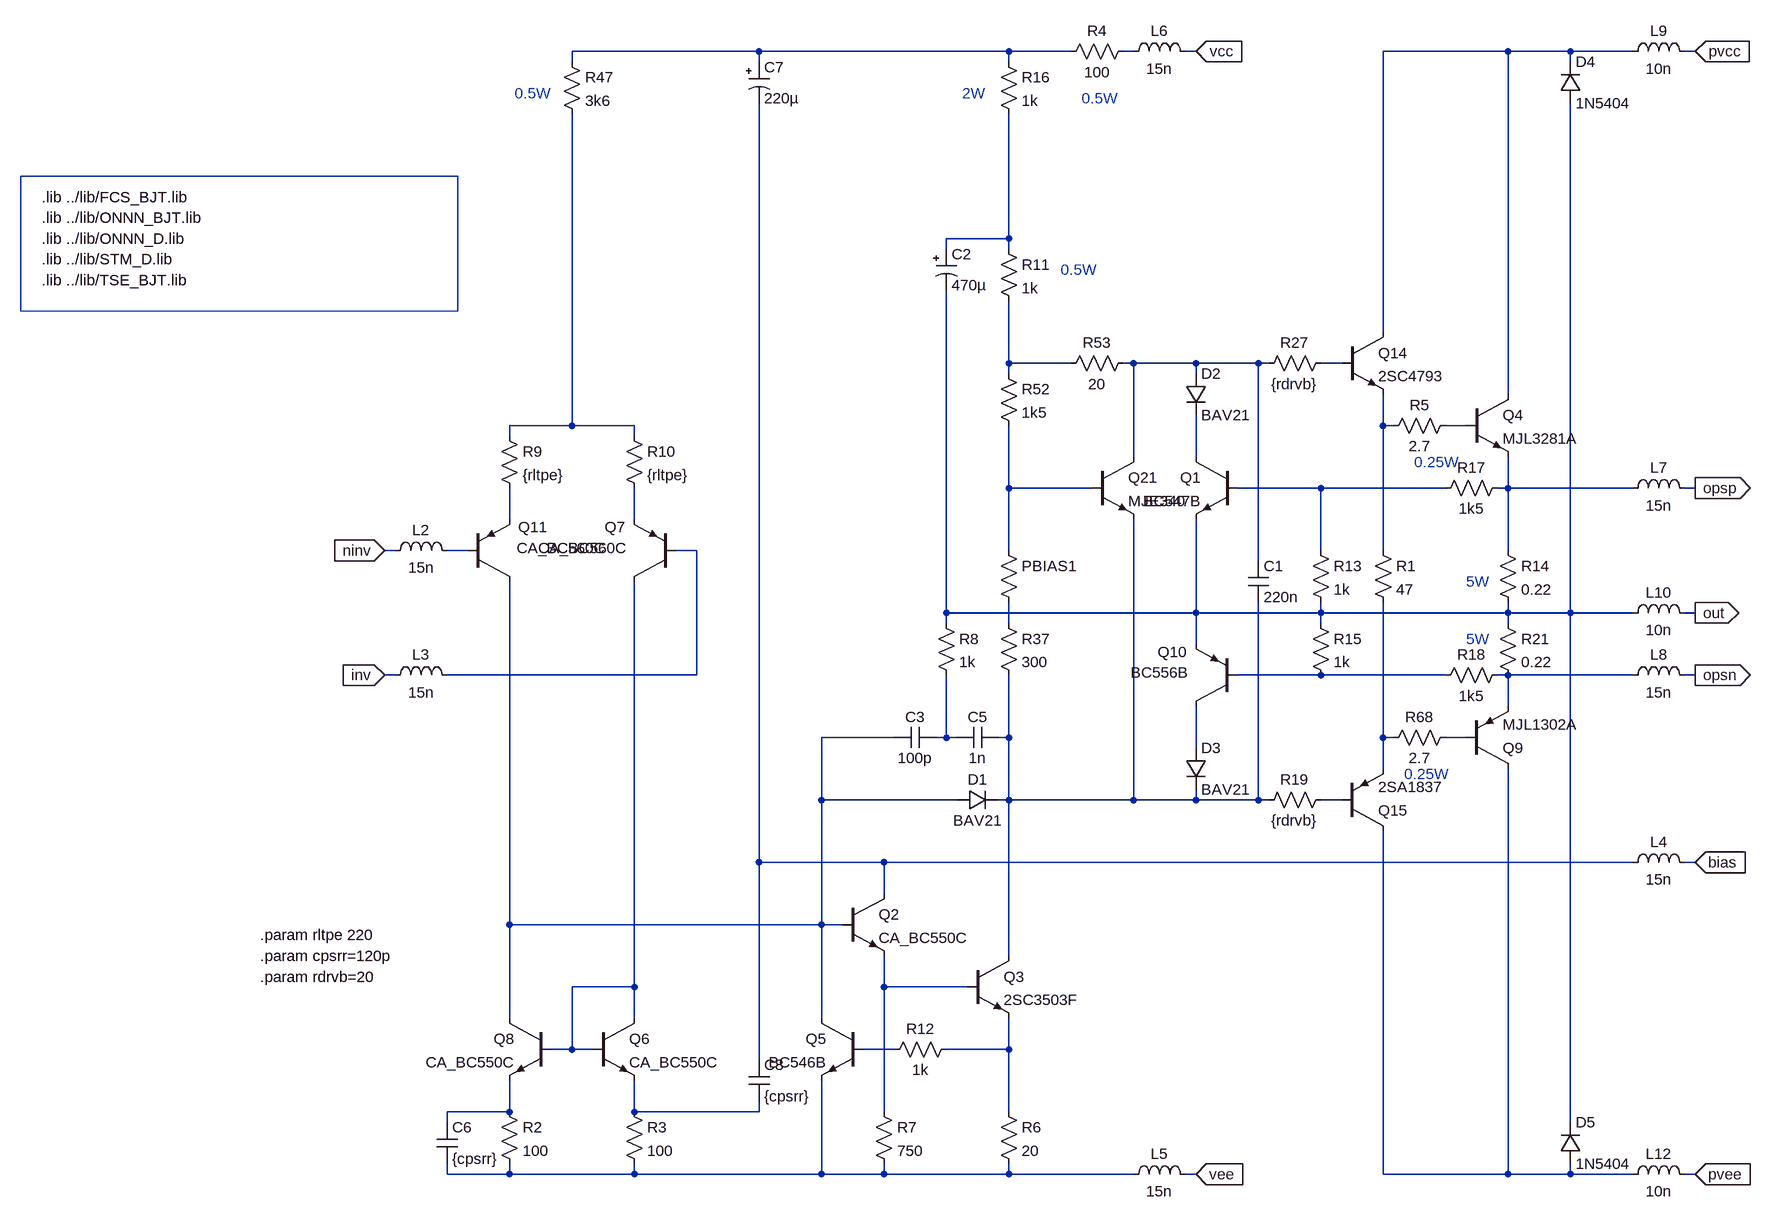
[diagram p0: schematic pab3bbb-compact-module.asc]
pab3bbb-compact-module.asc, the LTspice schematic file:
Version 4
SHEET 1 6124 2336
WIRE 384 -1088 96 -1088
WIRE 768 -1088 384 -1088
WIRE 864 -1088 768 -1088
WIRE 960 -1088 944 -1088
WIRE 1056 -1088 1040 -1088
WIRE 1536 -1088 1344 -1088
WIRE 1632 -1088 1536 -1088
WIRE 1728 -1088 1632 -1088
WIRE 1824 -1088 1808 -1088
WIRE 96 -1072 96 -1088
WIRE 384 -1072 384 -1088
WIRE 768 -1072 768 -1088
WIRE 1632 -1072 1632 -1088
WIRE 768 -800 768 -992
WIRE 768 -800 672 -800
WIRE 672 -784 672 -800
WIRE 768 -784 768 -800
WIRE 1344 -656 1344 -1088
WIRE 768 -608 768 -704
WIRE 864 -608 768 -608
WIRE 960 -608 944 -608
WIRE 1056 -608 960 -608
WIRE 1152 -608 1056 -608
WIRE 1168 -608 1152 -608
WIRE 1280 -608 1248 -608
WIRE 768 -592 768 -608
WIRE 1056 -592 1056 -608
WIRE 1536 -560 1536 -1088
WIRE 96 -512 96 -992
WIRE 96 -512 0 -512
WIRE 192 -512 96 -512
WIRE 1344 -512 1344 -560
WIRE 1360 -512 1344 -512
WIRE 1472 -512 1440 -512
WIRE 0 -496 0 -512
WIRE 192 -496 192 -512
WIRE 960 -464 960 -608
WIRE 1056 -464 1056 -528
WIRE 768 -416 768 -512
WIRE 896 -416 768 -416
WIRE 1248 -416 1120 -416
WIRE 1440 -416 1248 -416
WIRE 1536 -416 1536 -464
WIRE 1536 -416 1520 -416
WIRE 1728 -416 1536 -416
WIRE 1824 -416 1808 -416
WIRE 0 -368 0 -416
WIRE 192 -368 192 -416
WIRE -176 -320 -192 -320
WIRE -64 -320 -96 -320
WIRE 288 -320 256 -320
WIRE 768 -320 768 -416
WIRE 1248 -320 1248 -416
WIRE 1344 -320 1344 -512
WIRE 1536 -320 1536 -416
WIRE 1152 -304 1152 -608
WIRE 672 -224 672 -720
WIRE 1056 -224 1056 -368
WIRE 1056 -224 672 -224
WIRE 1248 -224 1248 -240
WIRE 1248 -224 1056 -224
WIRE 1536 -224 1536 -240
WIRE 1536 -224 1248 -224
WIRE 1632 -224 1632 -1008
WIRE 1632 -224 1536 -224
WIRE 1728 -224 1632 -224
WIRE 1824 -224 1808 -224
WIRE 672 -208 672 -224
WIRE 768 -208 768 -240
WIRE 1248 -208 1248 -224
WIRE 1536 -208 1536 -224
WIRE 1056 -176 1056 -224
WIRE -176 -128 -192 -128
WIRE 288 -128 288 -320
WIRE 288 -128 -96 -128
WIRE 1248 -128 1120 -128
WIRE 1440 -128 1248 -128
WIRE 1536 -128 1520 -128
WIRE 1728 -128 1536 -128
WIRE 1824 -128 1808 -128
WIRE 1536 -80 1536 -128
WIRE 592 -32 480 -32
WIRE 672 -32 672 -128
WIRE 672 -32 656 -32
WIRE 688 -32 672 -32
WIRE 768 -32 768 -128
WIRE 768 -32 752 -32
WIRE 1344 -32 1344 -240
WIRE 1360 -32 1344 -32
WIRE 1472 -32 1440 -32
WIRE 1056 -16 1056 -80
WIRE 1344 16 1344 -32
WIRE 480 64 480 -32
WIRE 688 64 480 64
WIRE 768 64 768 -32
WIRE 768 64 752 64
WIRE 960 64 960 -368
WIRE 960 64 768 64
WIRE 1056 64 1056 48
WIRE 1056 64 960 64
WIRE 1152 64 1152 -240
WIRE 1152 64 1056 64
WIRE 1168 64 1152 64
WIRE 1280 64 1248 64
WIRE 384 160 384 -1008
WIRE 576 160 384 160
WIRE 1728 160 576 160
WIRE 1824 160 1808 160
WIRE 576 208 576 160
WIRE 0 256 0 -272
WIRE 480 256 480 64
WIRE 480 256 0 256
WIRE 512 256 480 256
WIRE 768 304 768 64
WIRE 192 352 192 -272
WIRE 192 352 96 352
WIRE 576 352 576 304
WIRE 704 352 576 352
WIRE 0 400 0 256
WIRE 192 400 192 352
WIRE 480 400 480 256
WIRE 96 448 96 352
WIRE 96 448 64 448
WIRE 128 448 96 448
WIRE 592 448 544 448
WIRE 768 448 768 400
WIRE 768 448 672 448
WIRE 384 464 384 160
WIRE 0 544 0 496
WIRE 0 544 -96 544
WIRE 192 544 192 496
WIRE 384 544 384 528
WIRE 384 544 192 544
WIRE 576 544 576 352
WIRE 768 544 768 448
WIRE -96 560 -96 544
WIRE 1632 560 1632 -224
WIRE -96 640 -96 624
WIRE 0 640 0 624
WIRE 0 640 -96 640
WIRE 192 640 192 624
WIRE 192 640 0 640
WIRE 480 640 480 496
WIRE 480 640 192 640
WIRE 576 640 576 624
WIRE 576 640 480 640
WIRE 768 640 768 624
WIRE 768 640 576 640
WIRE 960 640 768 640
WIRE 1056 640 1040 640
WIRE 1344 640 1344 112
WIRE 1536 640 1536 16
WIRE 1536 640 1344 640
WIRE 1632 640 1632 624
WIRE 1632 640 1536 640
WIRE 1728 640 1632 640
WIRE 1824 640 1808 640
FLAG 1824 -1088 pvcc
IOPIN 1824 -1088 In
FLAG 1824 640 pvee
IOPIN 1824 640 In
FLAG 1824 -224 out
IOPIN 1824 -224 Out
FLAG 1056 -1088 vcc
IOPIN 1056 -1088 In
FLAG 1056 640 vee
IOPIN 1056 640 In
FLAG -192 -320 ninv
IOPIN -192 -320 In
FLAG -192 -128 inv
IOPIN -192 -128 In
FLAG 1824 -416 opsp
IOPIN 1824 -416 Out
FLAG 1824 -128 opsn
IOPIN 1824 -128 Out
FLAG 1824 160 bias
IOPIN 1824 160 In
SYMBOL pnp -64 -272 M180
WINDOW 0 77 84 Left 2
WINDOW 3 75 52 Left 2
SYMATTR InstName Q11
SYMATTR Value CA_BC560C
SYMBOL res -16 528 R0
SYMATTR InstName R2
SYMATTR Value 100
SYMBOL res 176 528 R0
SYMATTR InstName R3
SYMATTR Value 100
SYMBOL res -16 -512 R0
SYMATTR InstName R9
SYMATTR Value {rltpe}
SYMBOL res 176 -512 R0
SYMATTR InstName R10
SYMATTR Value {rltpe}
SYMBOL res 752 -1088 R0
SYMATTR InstName R16
SYMATTR Value 1k
SYMBOL res 1264 -624 R90
WINDOW 0 0 56 VBottom 2
WINDOW 3 32 56 VTop 2
SYMATTR InstName R27
SYMATTR Value {rdrvb}
SYMBOL res 80 -1088 R0
SYMATTR InstName R47
SYMATTR Value 3k6
SYMBOL res 752 -336 R0
WINDOW 3 36 76 Invisible 2
SYMATTR Value {1+(500*BIAS)}
SYMATTR InstName PBIAS1
SYMBOL res 752 -608 R0
SYMATTR InstName R52
SYMATTR Value 1k5
SYMBOL res 960 -624 R90
WINDOW 0 0 56 VBottom 2
WINDOW 3 32 56 VTop 2
SYMATTR InstName R53
SYMATTR Value 20
SYMBOL npn 704 304 R0
SYMATTR InstName Q3
SYMATTR Value 2SC3503F
SYMBOL res 752 528 R0
SYMATTR InstName R6
SYMATTR Value 20
SYMBOL pnp 256 -272 R180
WINDOW 0 77 84 Left 2
WINDOW 3 75 52 Left 2
SYMATTR InstName Q7
SYMATTR Value CA_BC560C
SYMBOL npn 896 -464 R0
SYMATTR InstName Q21
SYMATTR Value MJE340
SYMBOL res 752 -224 R0
SYMATTR InstName R37
SYMATTR Value 300
SYMBOL npn 1472 -560 R0
SYMATTR InstName Q4
SYMATTR Value MJL3281A
SYMBOL pnp 1472 16 M180
SYMATTR InstName Q9
SYMATTR Value MJL1302A
SYMBOL res 1456 -528 R90
WINDOW 0 0 56 VBottom 2
WINDOW 3 32 56 VTop 2
SYMATTR InstName R5
SYMATTR Value 2.7
SYMBOL res 1456 -48 R90
WINDOW 0 0 56 VBottom 2
WINDOW 3 32 56 VTop 2
SYMATTR InstName R68
SYMATTR Value 2.7
SYMBOL cap 656 -48 R90
WINDOW 0 0 32 VBottom 2
WINDOW 3 32 32 VTop 2
SYMATTR InstName C3
SYMATTR Value 100p
SYMATTR SpiceLine V=100 Irms=20.8m Rser=5.448 Lser=3n Rpar=6.4meg Cpar=1p
SYMBOL npn 128 400 R0
SYMATTR InstName Q6
SYMATTR Value CA_BC550C
SYMBOL npn 64 400 M0
SYMATTR InstName Q8
SYMATTR Value CA_BC550C
SYMBOL npn 512 208 R0
SYMATTR InstName Q2
SYMATTR Value CA_BC550C
SYMBOL res 560 528 R0
SYMATTR InstName R7
SYMATTR Value 750
SYMBOL cap 752 -48 R90
WINDOW 0 0 32 VBottom 2
WINDOW 3 32 32 VTop 2
SYMATTR InstName C5
SYMATTR Value 1n
SYMATTR SpiceLine V=100 Irms=75.3m Rser=2.89088 Lser=3n Rpar=4.4meg Cpar=1p
SYMBOL res 656 -224 R0
SYMATTR InstName R8
SYMATTR Value 1k
SYMBOL diode 688 80 R270
WINDOW 0 32 32 VTop 2
WINDOW 3 0 32 VBottom 2
SYMATTR InstName D1
SYMATTR Value BAV21
SYMBOL res 1520 -336 R0
SYMATTR InstName R14
SYMATTR Value 0.22
SYMBOL res 1520 -224 R0
SYMATTR InstName R21
SYMATTR Value 0.22
SYMBOL cap 1136 -240 M180
WINDOW 0 24 56 Left 2
WINDOW 3 24 8 Left 2
SYMATTR InstName C1
SYMATTR Value 220n
SYMATTR SpiceLine V=25 Irms=1.76 Rser=0.057522 Lser=3n Rpar=4.4meg Cpar=1p
SYMBOL ind 944 656 R270
WINDOW 0 32 56 VTop 2
WINDOW 3 5 56 VBottom 2
SYMATTR InstName L5
SYMATTR Value 15n
SYMATTR SpiceLine Rser=20m
SYMBOL ind 944 -1072 R270
WINDOW 0 32 56 VTop 2
WINDOW 3 5 56 VBottom 2
SYMATTR InstName L6
SYMATTR Value 15n
SYMATTR SpiceLine Rser=20m
SYMBOL ind 1712 -400 R270
WINDOW 0 32 56 VTop 2
WINDOW 3 5 56 VBottom 2
SYMATTR InstName L7
SYMATTR Value 15n
SYMATTR SpiceLine Rser=20m
SYMBOL ind 1712 -112 R270
WINDOW 0 32 56 VTop 2
WINDOW 3 5 56 VBottom 2
SYMATTR InstName L8
SYMATTR Value 15n
SYMATTR SpiceLine Rser=20m
SYMBOL ind -192 -304 R270
WINDOW 0 32 56 VTop 2
WINDOW 3 5 56 VBottom 2
SYMATTR InstName L2
SYMATTR Value 15n
SYMATTR SpiceLine Rser=20m
SYMBOL ind -192 -112 R270
WINDOW 0 32 56 VTop 2
WINDOW 3 5 56 VBottom 2
SYMATTR InstName L3
SYMATTR Value 15n
SYMATTR SpiceLine Rser=20m
SYMBOL ind 1712 -208 R270
WINDOW 0 32 56 VTop 2
WINDOW 3 5 56 VBottom 2
SYMATTR InstName L10
SYMATTR Value 10n
SYMATTR SpiceLine Rser=10m
SYMBOL ind 1712 -1072 R270
WINDOW 0 32 56 VTop 2
WINDOW 3 5 56 VBottom 2
SYMATTR InstName L9
SYMATTR Value 10n
SYMATTR SpiceLine Rser=10m
SYMBOL ind 1712 656 R270
WINDOW 0 32 56 VTop 2
WINDOW 3 5 56 VBottom 2
SYMATTR InstName L12
SYMATTR Value 10n
SYMATTR SpiceLine Rser=10m
SYMBOL npn 1280 -656 R0
SYMATTR InstName Q14
SYMATTR Value 2SC4793
SYMBOL pnp 1280 112 M180
SYMATTR InstName Q15
SYMATTR Value 2SA1837
SYMBOL res 1328 -336 R0
SYMATTR InstName R1
SYMATTR Value 47
SYMBOL ind 1712 176 R270
WINDOW 0 32 56 VTop 2
WINDOW 3 5 56 VBottom 2
SYMATTR InstName L4
SYMATTR Value 15n
SYMATTR SpiceLine Rser=20m
SYMBOL polcap 368 -1072 R0
SYMATTR InstName C7
SYMATTR Value 220µ
SYMATTR SpiceLine V=63 Irms=2.77 Rser=0.070 Lser=5n Rpar=900k Cpar=3p
SYMATTR Description Capacitor
SYMATTR Type cap
SYMBOL npn 544 400 M0
SYMATTR InstName Q5
SYMATTR Value BC546B
SYMBOL res 688 432 R90
WINDOW 0 0 56 VBottom 2
WINDOW 3 32 56 VTop 2
SYMATTR InstName R12
SYMATTR Value 1k
SYMBOL res 960 -1104 R90
WINDOW 0 0 56 VBottom 2
WINDOW 3 32 56 VTop 2
SYMATTR InstName R4
SYMATTR Value 100
SYMBOL polcap 656 -784 R0
SYMATTR InstName C2
SYMATTR Value 470µ
SYMATTR SpiceLine V=63 Irms=2.77 Rser=0.070 Lser=5n Rpar=900k Cpar=3p
SYMATTR Description Capacitor
SYMATTR Type cap
SYMBOL res 752 -800 R0
SYMATTR InstName R11
SYMATTR Value 1k
SYMBOL npn 1120 -464 M0
SYMATTR InstName Q1
SYMATTR Value BC547B
SYMBOL pnp 1120 -80 R180
WINDOW 0 77 84 Left 2
WINDOW 3 75 52 Left 2
SYMATTR InstName Q10
SYMATTR Value BC556B
SYMBOL diode 1040 -592 R0
SYMATTR InstName D2
SYMATTR Value BAV21
SYMBOL diode 1040 -16 R0
SYMATTR InstName D3
SYMATTR Value BAV21
SYMBOL res 1232 -336 R0
SYMATTR InstName R13
SYMATTR Value 1k
SYMBOL res 1232 -224 R0
SYMATTR InstName R15
SYMATTR Value 1k
SYMBOL res 1536 -432 R90
WINDOW 0 0 56 VBottom 2
WINDOW 3 32 56 VTop 2
SYMATTR InstName R17
SYMATTR Value 1k5
SYMBOL res 1536 -144 R90
WINDOW 0 0 56 VBottom 2
WINDOW 3 32 56 VTop 2
SYMATTR InstName R18
SYMATTR Value 1k5
SYMBOL diode 1616 -1008 M180
WINDOW 0 24 64 Left 2
WINDOW 3 24 0 Left 2
SYMATTR InstName D4
SYMATTR Value 1N5404
SYMBOL diode 1616 624 M180
WINDOW 0 24 64 Left 2
WINDOW 3 24 0 Left 2
SYMATTR InstName D5
SYMATTR Value 1N5404
SYMBOL cap -112 560 R0
SYMATTR InstName C6
SYMATTR Value {cpsrr}
SYMBOL cap 368 464 R0
SYMATTR InstName C8
SYMATTR Value {cpsrr}
SYMBOL res 1264 48 R90
WINDOW 0 0 56 VBottom 2
WINDOW 3 32 56 VTop 2
SYMATTR InstName R19
SYMATTR Value {rdrvb}
TEXT -384 304 Left 2 !.param cpsrr=120p
TEXT -384 272 Left 2 !.param rltpe 220
TEXT 8 -1024 Left 2 ;0.5W
TEXT 696 -1024 Left 2 ;2W
TEXT 848 -752 Left 2 ;0.5W
TEXT 1392 -456 Left 2 ;0.25W
TEXT 1376 24 Left 2 ;0.25W
TEXT 1472 -272 Left 2 ;5W
TEXT 1472 -184 Left 2 ;5W
TEXT 880 -1016 Left 2 ;0.5W
TEXT -720 -832 Left 2 !.lib ../lib/ONNN_BJT.lib
TEXT -720 -768 Left 2 !.lib ../lib/STM_D.lib
TEXT -720 -864 Left 2 !.lib ../lib/FCS_BJT.lib
TEXT -720 -800 Left 2 !.lib ../lib/ONNN_D.lib
TEXT -720 -736 Left 2 !.lib ../lib/TSE_BJT.lib
TEXT -384 336 Left 2 !.param rdrvb=20
RECTANGLE Normal -80 -688 -752 -896

The netlist it stands for:
* pab3bbb-compact-module.asc
Q11 N023 N017 N015 0 CA_BC560C
R2 N035 N037 100
R3 N036 N037 100
R9 N008 N015 {rltpe}
R10 N008 N016 {rltpe}
R16 N001 N004 1k
R27 N007 N006 {rdrvb}
R47 N001 N008 3k6
R§PBIAS1 N012 N020 {1+(500*BIAS)}
R52 N005 N012 1k5
R53 N006 N005 20
Q3 N025 N032 N034 0 2SC3503F
R6 N034 N037 20
Q7 N031 N018 N016 0 CA_BC560C
Q21 N006 N012 N025 0 MJE340
R37 N020 N025 300
Q4 N003 N010 N014 0 MJL3281A
Q9 N038 N027 N022 0 MJL1302A
R5 N010 N009 2.7
R68 N027 N026 2.7
C3 N024 N023 100p V=100 Irms=20.8m Rser=5.448 Lser=3n Rpar=6.4meg Cpar=1p
Q6 N031 N031 N036 0 CA_BC550C
Q8 N023 N031 N035 0 CA_BC550C
Q2 N030 N023 N032 0 CA_BC550C
R7 N032 N037 750
C5 N025 N024 1n V=100 Irms=75.3m Rser=2.89088 Lser=3n Rpar=4.4meg Cpar=1p
R8 N019 N024 1k
D1 N023 N025 BAV21
R14 N014 N019 0.22
R21 N019 N022 0.22
C1 N025 N006 220n V=25 Irms=1.76 Rser=0.057522 Lser=3n Rpar=4.4meg Cpar=1p
L5 N037 vee 15n Rser=20m
L6 N002 vcc 15n Rser=20m
L7 N014 opsp 15n Rser=20m
L8 N022 opsn 15n Rser=20m
L2 ninv N017 15n Rser=20m
L3 inv N018 15n Rser=20m
L10 N019 out 10n Rser=10m
L9 N003 pvcc 10n Rser=10m
L12 N038 pvee 10n Rser=10m
Q14 N003 N007 N009 0 2SC4793
Q15 N038 N029 N026 0 2SA1837
R1 N009 N026 47
L4 N030 bias 15n Rser=20m
C7 N001 N030 220µ V=63 Irms=2.77 Rser=0.070 Lser=5n Rpar=900k Cpar=3p
Q5 N023 N033 N037 0 BC546B
R12 N034 N033 1k
R4 N002 N001 100
C2 N004 N019 470µ V=63 Irms=2.77 Rser=0.070 Lser=5n Rpar=900k Cpar=3p
R11 N004 N005 1k
Q1 N011 N013 N019 0 BC547B
Q10 N028 N021 N019 0 BC556B
D2 N006 N011 BAV21
D3 N028 N025 BAV21
R13 N013 N019 1k
R15 N019 N021 1k
R17 N014 N013 1k5
R18 N022 N021 1k5
D4 N019 N003 1N5404
D5 N038 N019 1N5404
C6 N035 N037 {cpsrr}
C8 N030 N036 {cpsrr}
R19 N029 N025 {rdrvb}
.model D D
.lib standard.dio
.model NPN NPN
.model PNP PNP
.lib standard.bjt
.param cpsrr=120p
.param rltpe 220
* 0.5W
* 2W
* 0.5W
* 0.25W
* 0.25W
* 5W
* 5W
* 0.5W
.lib ../lib/ONNN_BJT.lib
.lib ../lib/STM_D.lib
.lib ../lib/FCS_BJT.lib
.lib ../lib/ONNN_D.lib
.lib ../lib/TSE_BJT.lib
.param rdrvb=20
.backanno
.end